# Altium schematic sheet Oscillators.SchDoc
size Letter
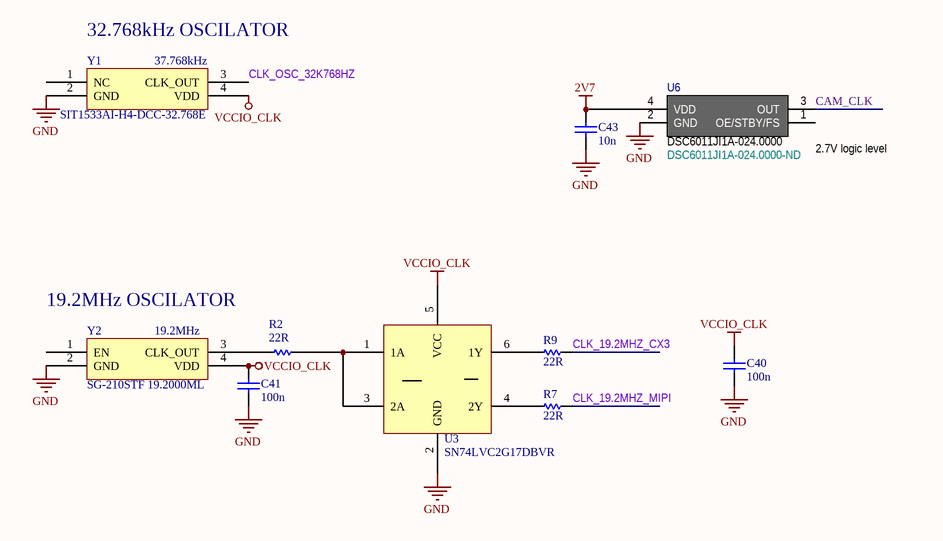
[diagram p0: Oscillators.SchDoc]

## Parts
C40  100n  [CAPC0603N]
C41  100n  [CAPC0603N]
C43  10n  [CAPC0603N]
R2  22R  [RESC0603N]
R7  22R  [RESC0603N]
R9  22R  [RESC0603N]
U3  SN74LVC2G17DBVR  [SOT-23_A_N]
U6  DSC6011JI1A-024.0000  Supplier Part Number 1: DSC6011JI1A-024.0000-ND  [XTAL2520-4]
Y1  SIT1533AI-H4-DCC-32.768E  value 37.768kHz  [SiT1533]
Y2  SG-210STF 19.2000ML  value 19.2MHz  [SG5032]

## Nets
2V7: C43.2 U6.4(VDD)
GND: C40.2 C41.2 C43.1 U3.2(GND) U6.2(GND) Y1.2(GND) Y2.2(GND)
VCCIO_CLK: C40.1 C41.1 U3.5(VCC) Y1.4(VDD) Y2.4(VDD)
CAM_CLK: U6.3(OUT)
CLK_19.2MHZ_CX3: R9.1
CLK_19.2MHZ_MIPI: R7.1
CLK_OSC_32K768HZ: Y1.3(CLK_OUT)
NetR2_1: R2.1 Y2.3(CLK_OUT)
NetR2_2: R2.2 U3.1(1A) U3.3(2A)
NetR7_2: R7.2 U3.4(2Y)
NetR9_2: R9.2 U3.6(1Y)

Not connected (* = marked no-connect by the designer): U6 1(OE/STBY/FS); Y1 1(NC); Y2 1(EN)

## Notes on the sheet
- (near Y1) 32.768kHz OSCILATOR
- (near U6) 2.7V logic level
- (near Y2) 19.2MHz OSCILATOR

## Library data of the parts
C40 C41 C43 = Cap Semi: Capacitor (Semiconductor SIM Model); Published: 8-Jun-2000; LatestRevisionDate: 29-May-2009; LatestRevisionNote: IPC-7351 Footprint Added.; PackageReference: C1206; Publisher: Altium Limited; PackageDescription: Chip Capacitor; Supplier 1: Digi-Key
  C40 C41: Supplier Part Number 1: 490-5405-1-ND
  C43: Supplier Part Number 1: 490-14453-1-ND
R2 R7 R9 = Res Semi: Semiconductor Resistor; Published: 8-Jun-2000; LatestRevisionDate: 17-Jul-2002; LatestRevisionNote: Re-released for DXP Platform.; PackageReference: AXIAL-0.5; Publisher: Altium Limited; PackageDescription: Axial Device, Thru-Hole; 2 Leads; 0.5 in Pin Spacing
U6 = DSC6011JI1A-024.0000: OSC MEMS 24.0000MHZ CMOS SMD; Manufacturer: Microchip Technology; Frequency: 24MHz; Function: Standby (Power Down); Voltage - Supply: 1.71 V ~ 3.63 V; Frequency Stability: ±50ppm; Current - Supply (Max): 1.3mA (Typ); Current - Supply (Disable) (Max): 12µA; Supplier 1: Digi-Key; Manufacturer Part Number: DSC6011JI1A-024.0000; RoHS: RoHS Compliant; Category: Crystals, Oscillators, Resonators; Stock 1: 1063; Pricing 1: 1=0.89, 25=0.7312, 100=0.6695 (USD); Packaging: Bulk; Part Status: Active; Type: MEMS (Silicon); Output: CMOS; Operating Temperature: -40°C ~ 85°C; Ratings: AEC-Q100; Mounting Type: Surface Mount; Package / Case: 4-SMD, No Lead; Size / Dimension: 0.098" L x 0.079" W (2.50mm x 2.00mm); Height - Seated (Max): 0.035" (0.90mm); ComponentLink1URL: http://www.microchip.com/mymicrochip/filehandler.aspx?ddocname=en587489; ComponentLink1Description: http://www.microchip.com/mymicrochip/filehandler.aspx?ddocname=en587489
Y1 = OSCILATOR_32kHz
Y2 = OSCILLATOR